# Altium project PCM.PrjPcb
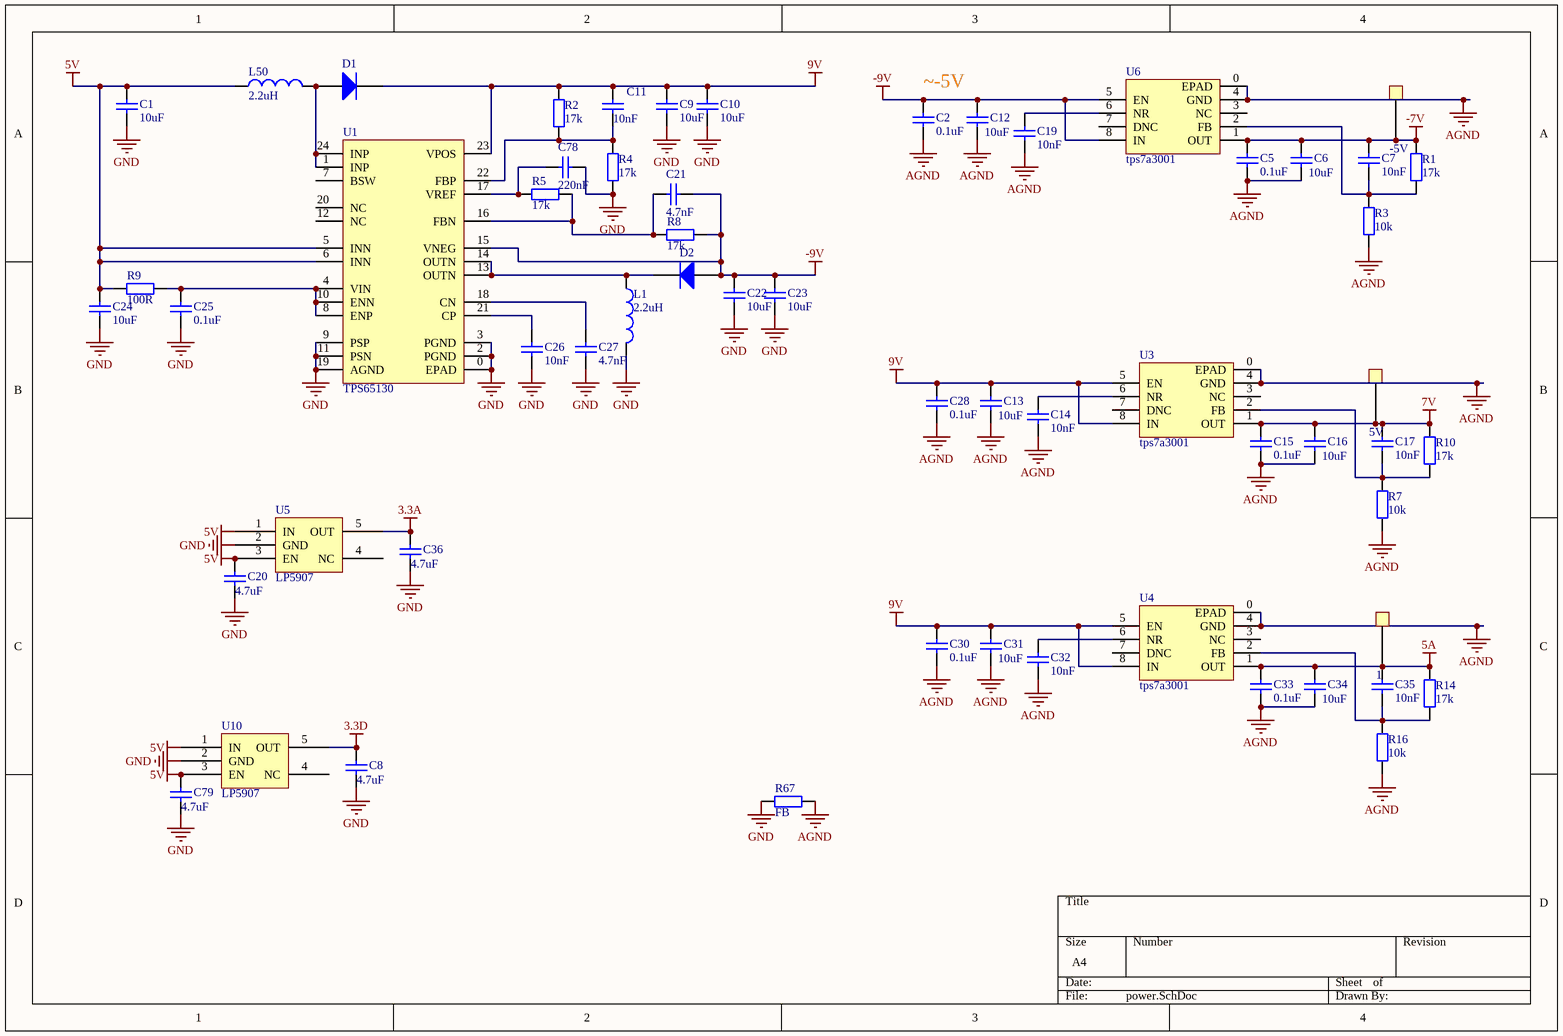
[diagram p0: power.SchDoc]
3 sheets, 169 parts. Net scope: flat (ports and power ports of the same name join across sheets).
Board file: PCM.PcbDoc
Sheets:
  power.SchDoc
  audio.SchDoc
  MCU.SchDoc

## Sheet power.SchDoc
size A4

### Parts
1  TestPad  [TestPad]  (value not drawn)
5V  TestPad  [TestPad]  (value not drawn)
-5V  TestPad  [TestPad]  (value not drawn)
C1  10uF  [0603L]
C2  0.1uF  [0603L]
C5  0.1uF  [0603L]
C6  10uF  [0805]
C7  10nF  [0402]
C8  4.7uF  [0603L]
C9  10uF  [0603L]
C10  10uF  [0603L]
C11  10nF  [0402]
C12  10uF  [0805]
C13  10uF  [0805]
C14  10nF  [0402]
C15  0.1uF  [0603L]
C16  10uF  [0805]
C17  10nF  [0402]
C19  10nF  [0402]
C20  4.7uF  [0603L]
C21  4.7nF  [0402]
C22  10uF  [0603L]
C23  10uF  [0603L]
C24  10uF  [0603L]
C25  0.1uF  [0402]
C26  10nF  [0402]
C27  4.7nF  [0402]
C28  0.1uF  [0603L]
C30  0.1uF  [0603L]
C31  10uF  [0805]
C32  10nF  [0402]
C33  0.1uF  [0603L]
C34  10uF  [0805]
C35  10nF  [0402]
C36  4.7uF  [0603L]
C78  220nF  [0402]
C79  4.7uF  [0603L]
D1  (no value)  [LC-SOD-323]
D2  (no value)  [LC-SOD-323]
L1  2.2uH  [L4015]
L50  2.2uH  [L4015]
R1  17k  [0402]
R2  17k  [0402]
R3  10k  [0402]
R4  17k  [0402]
R5  17k  [0402]
R7  10k  [0402]
R8  17k  [0402]
R9  100R  [0402]
R10  17k  [0402]
R14  17k  [0402]
R16  10k  [0402]
R67  FB  [0603L]
U1  TPS65130  [TPS65130]
U3  tps7a3001  [MSOP8/VSSOP8+PAD]
U4  tps7a3001  [MSOP8/VSSOP8+PAD]
U5  LP5907  [SOT23-5]
U6  tps7a3001  [MSOP8/VSSOP8+PAD]
U10  LP5907  [SOT23-5]

### Nets
3.3A: C36.2 U5.5(OUT)
3.3D: C8.2 U10.5(OUT)
5A: 1.1 C33.1 C34.2 C35.1 R14.2 U4.1(OUT)
5V: C1.1 C20.2 C24.1 C79.2 L50.1 R9.2 U1.5(INN) U1.6(INN) U5.1(IN) U5.3(EN) U10.1(IN) U10.3(EN)
7V: 5V.1 C15.1 C16.2 C17.1 R10.2 U3.1(OUT)
9V: C9.1 C10.1 C11.1 C13.2 C28.1 C30.1 C31.2 D1.2(K) R2.2 U1.23(VPOS) U3.5(EN) U3.8(IN) U4.5(EN) U4.8(IN)
-7V: -5V.1 C5.1 C6.2 C7.1 R1.2 U6.1(OUT)
-9V: C2.1 C12.2 C21.2 C22.1 C23.1 D2.1(A) R8.2 U1.15(VNEG) U6.5(EN) U6.8(IN)
AGND: C2.2 C5.2 C6.1 C12.1 C13.1 C14.2 C15.2 C16.1 C19.2 C28.2 C30.2 C31.1 C32.2 C33.2 C34.1 R3.1 R7.1 R16.1 R67.1 U3.0(EPAD) U3.4(GND) U4.0(EPAD) U4.4(GND) U6.0(EPAD) U6.4(GND)
GND: C1.2 C8.1 C9.2 C10.2 C20.1 C22.2 C23.2 C24.2 C25.2 C26.2 C27.2 C36.1 C78.2 C79.1 L1.2 R4.1 R67.2 U1.0(EPAD) U1.2(PGND) U1.3(PGND) U1.9(PSP) U1.11(PSN) U1.19(AGND) U5.2(GND) U10.2(GND)
NetC7_2: C7.2 R1.1 R3.2 U6.2(FB)
NetC11_2: C11.2 R2.1 R4.2 U1.22(FBP)
NetC14_1: C14.1 U3.6(NR)
NetC17_2: C17.2 R7.2 R10.1 U3.2(FB)
NetC19_1: C19.1 U6.6(NR)
NetC21_1: C21.1 R5.1 R8.1 U1.16(FBN)
NetC25_1: C25.1 R9.1 U1.4(VIN) U1.8(ENP) U1.10(ENN)
NetC26_1: C26.1 U1.21(CP)
NetC27_1: C27.1 U1.18(CN)
NetC32_1: C32.1 U4.6(NR)
NetC35_2: C35.2 R14.1 R16.2 U4.2(FB)
NetC78_1: C78.1 R5.2 U1.17(VREF)
NetD1_1: D1.1(A) L50.2 U1.1(INP) U1.24(INP)
NetD2_2: D2.2(K) L1.1 U1.13(OUTN) U1.14(OUTN)

Not connected (* = marked no-connect by the designer): U1 7(BSW) 12(NC) 20(NC); U3 3(NC) 7(DNC); U4 3(NC) 7(DNC); U5 4(NC); U6 3(NC) 7(DNC); U10 4(NC)

### Notes on the sheet
- ~-5V

### Library data of the parts
C1 C2 C5-C17 C19-C28 C30-C36 C78 C79 = Cap: Capacitor; Published: 8-Jun-2000; LatestRevisionDate: 17-Jul-2002; LatestRevisionNote: Re-released for DXP Platform.; PackageReference: RAD-0.3; Publisher: Altium Limited; PackageDescription: Radial Cap, Thru-Hole; 2 Leads; 0.3 in Pin Spacing
D1 D2 = Diode 1N4148: High Conductance Fast Diode; Published: 8-Jun-2000; LatestRevisionDate: 17-Jul-2002; LatestRevisionNote: Re-released for DXP Platform.; DatasheetVersion: 1997; PackageReference: DO-35; Publisher: Altium Limited; PackageDescription: Diode, Axial; Body 3.8 x 1.9 mm (LxDia. max), Lead Dia. 0.53 mm (max); Code_JEDEC: DO-204-AH; ComponentLink1Description: Manufacturer Link; ComponentLink1URL: http://www.fairchildsemi.com/; ComponentLink2Description: Datasheet; ComponentLink2URL: http://www.fairchildsemi.com/ds/1N%2F1N4148.pdf
L1 L50 = Inductor: Code_IEC: 1005; Published: 8-Jun-2000; LatestRevisionDate: 29-May-2009; LatestRevisionNote: IPC-7351 Footprint Added.; PackageReference: 0402-A; Publisher: Altium Limited; PackageDescription: Chip Inductor; Code_JEITA: 0402
R1-R5 R7-R10 R14 R16 R67 = Res2: Resistor; Published: 8-Jun-2000; LatestRevisionDate: 17-Jul-2002; LatestRevisionNote: Re-released for DXP Platform.; PackageReference: AXIAL-0.4; Publisher: Altium Limited; PackageDescription: Axial Device, Thru-Hole; 2 Leads; 0.4 in Pin Spacing

## Sheet audio.SchDoc
size A3
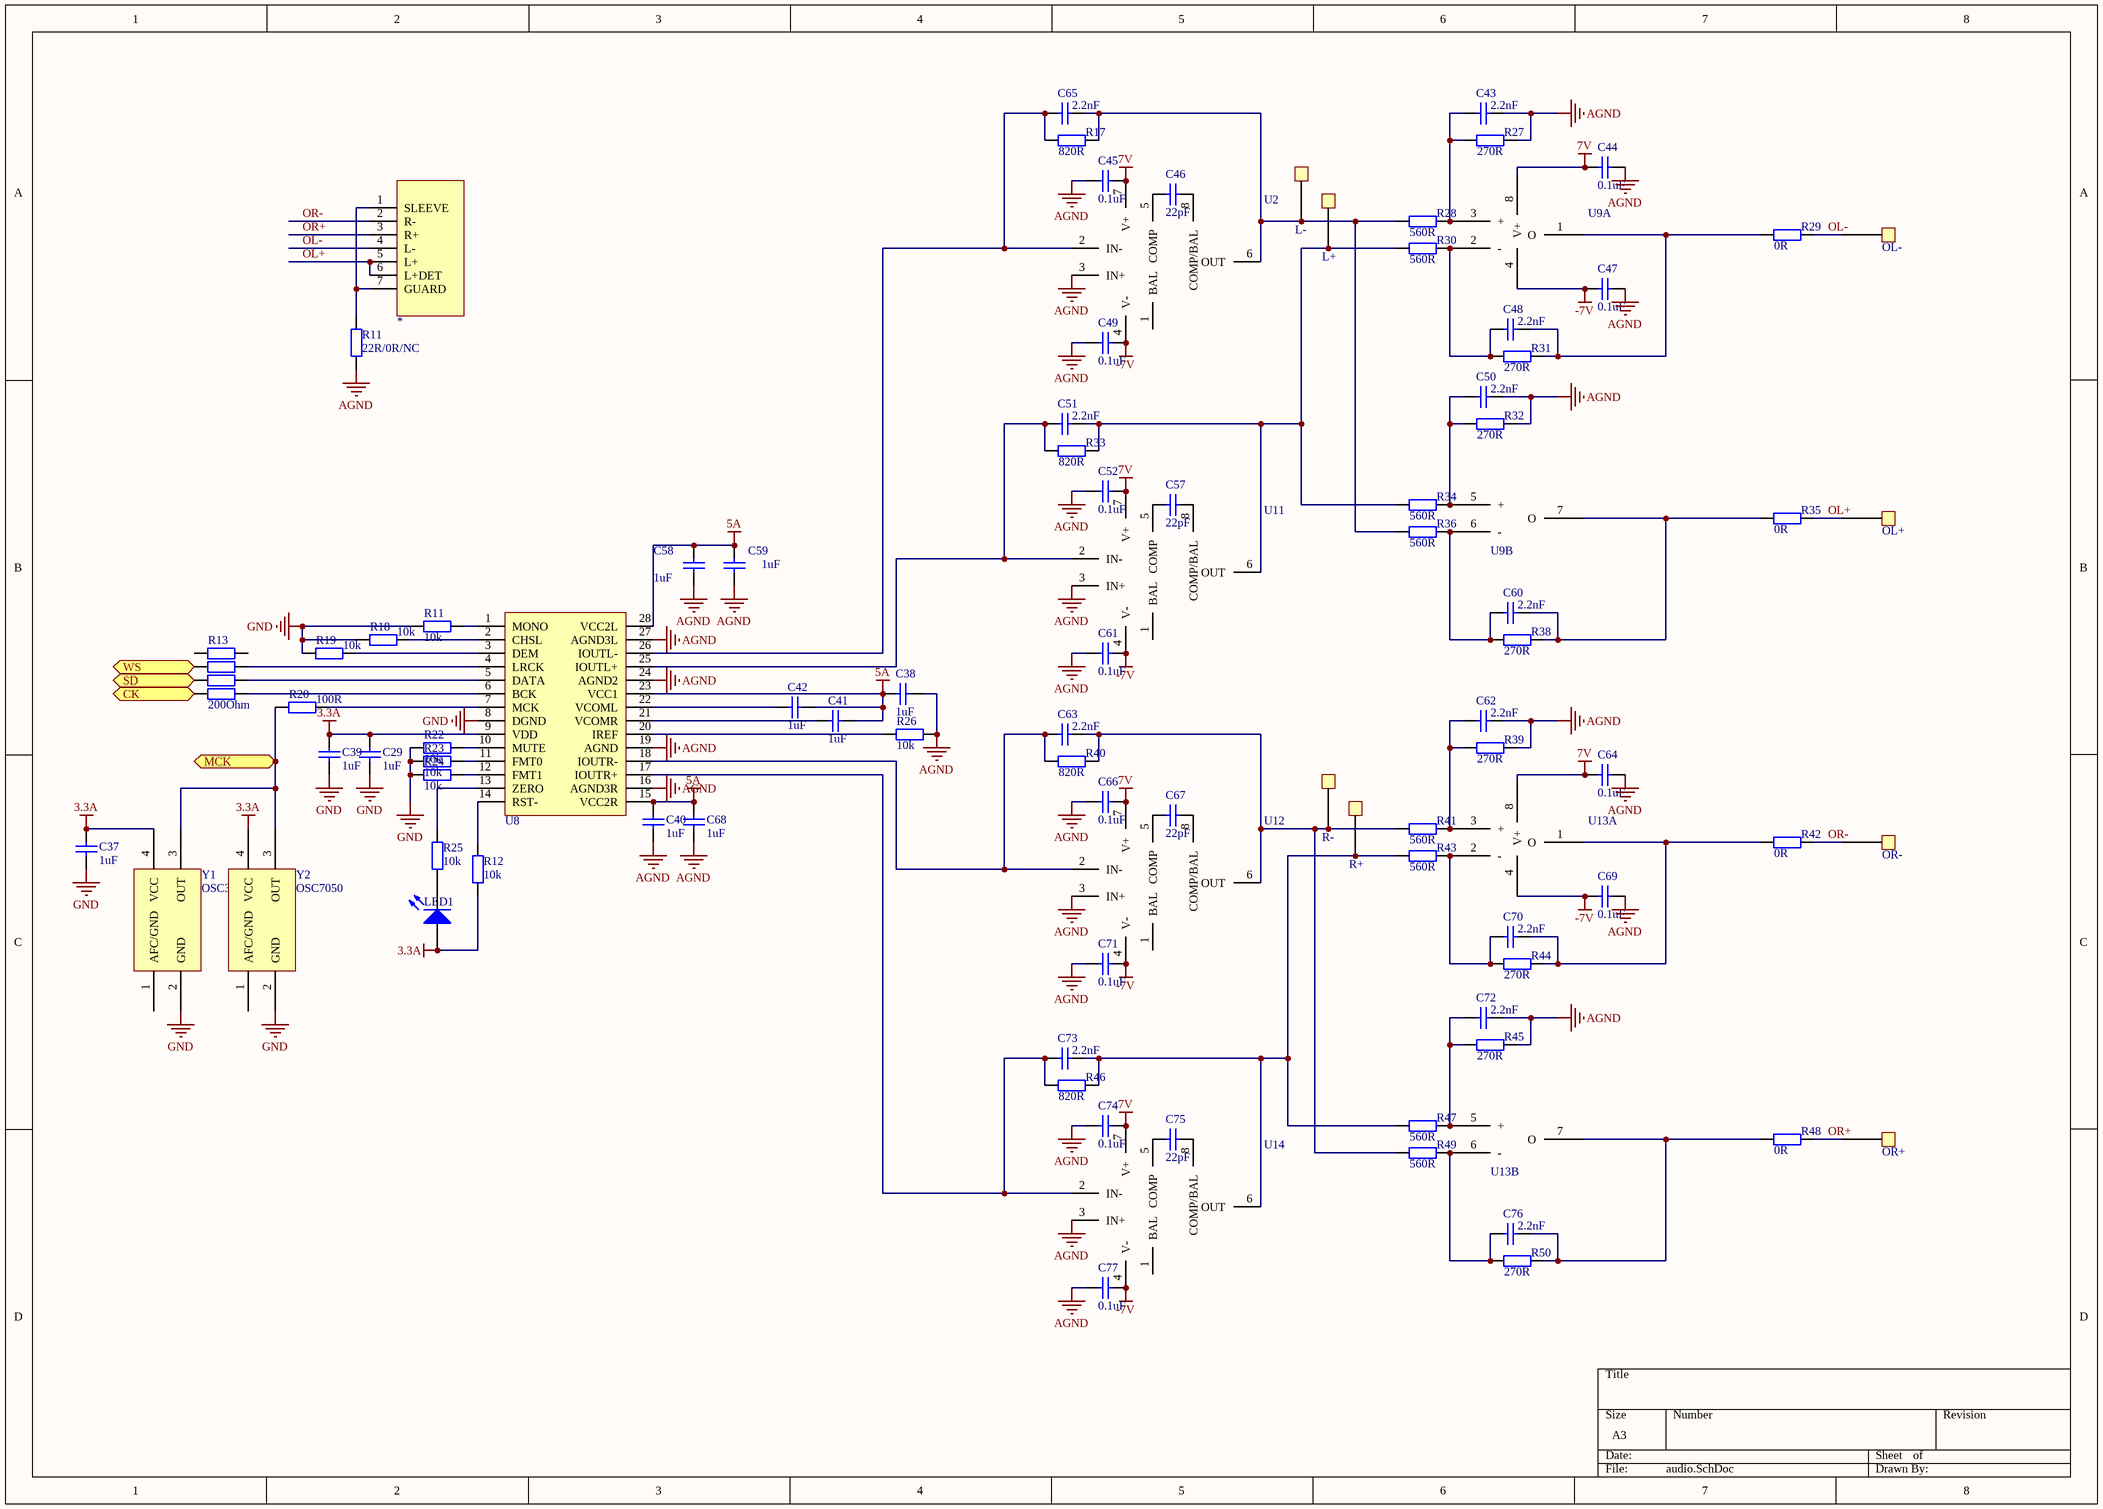
[diagram p1: audio.SchDoc]

### Parts
(Parts that share a designator on the sheet are numbered #1, #2 ... from top to bottom, then left to right.)
*  4.4BAL  [4.4BAL]  (value not drawn)
C29  1uF  [0402]
C37  1uF  [0402]
C38  1uF  [0603L]
C39  1uF  [0402]
C40  1uF  [0402]
C41  1uF  [1206]
C42  1uF  [1206]
C43  2.2nF  [0805]
C44  0.1uF  [0402]
C45  0.1uF  [0402]
C46  22pF  [0402]
C47  0.1uF  [0402]
C48  2.2nF  [0805]
C49  0.1uF  [0402]
C50  2.2nF  [0805]
C51  2.2nF  [0805]
C52  0.1uF  [0402]
C57  22pF  [0402]
C58  1uF  [0402]
C59  1uF  [0603L]
C60  2.2nF  [0805]
C61  0.1uF  [0402]
C62  2.2nF  [0805]
C63  2.2nF  [0805]
C64  0.1uF  [0402]
C65  2.2nF  [0805]
C66  0.1uF  [0402]
C67  22pF  [0402]
C68  1uF  [0603L]
C69  0.1uF  [0402]
C70  2.2nF  [0805]
C71  0.1uF  [0402]
C72  2.2nF  [0805]
C73  2.2nF  [0805]
C74  0.1uF  [0402]
C75  22pF  [0402]
C76  2.2nF  [0805]
C77  0.1uF  [0402]
L+  TestPad  [TestPad]  (value not drawn)
L-  TestPad  [TestPad]  (value not drawn)
LED1  LED0  [0603]  (value not drawn)
OL+  TestPad  [TestPad]  (value not drawn)
OL-  TestPad  [TestPad]  (value not drawn)
OR+  TestPad  [TestPad]  (value not drawn)
OR-  TestPad  [TestPad]  (value not drawn)
R11#1  22R/0R/NC  [0603L]
R11#2  10k  [0402]
R12  10k  [0402]
R13  value 200Ohm  [0402X4]  (hidden comment: Res*4)
R17  820R  [0402]
R18  10k  [0402]
R19  10k  [0402]
R20  100R  [0402]
R22  10k  [0402]
R23  10k  [0402]
R24  10k  [0402]
R25  10k  [0402]
R26  10k  [0603L]
R27  270R  [0402]
R28  560R  [0402]
R29  0R  [0603L]
R30  560R  [0402]
R31  270R  [0402]
R32  270R  [0402]
R33  820R  [0402]
R34  560R  [0402]
R35  0R  [0603L]
R36  560R  [0402]
R38  270R  [0402]
R39  270R  [0402]
R40  820R  [0402]
R41  560R  [0402]
R42  0R  [0603L]
R43  560R  [0402]
R44  270R  [0402]
R45  270R  [0402]
R46  820R  [0402]
R47  560R  [0402]
R48  0R  [0603L]
R49  560R  [0402]
R50  270R  [0402]
R+  TestPad  [TestPad]  (value not drawn)
R-  TestPad  [TestPad]  (value not drawn)
U2  NE5534  [SO8]  (value not drawn)
U8  PCM1794  [PCM1794]  (value not drawn)
U9  OP-2  [SO8]  (value not drawn)  (parts A,B of 2)
U11  NE5534  [SO8]  (value not drawn)
U12  NE5534  [SO8]  (value not drawn)
U13  OP-2  [SO8]  (value not drawn)  (parts A,B of 2)
U14  NE5534  [SO8]  (value not drawn)
Y1  OSC3225  [TXC_7Q]
Y2  OSC7050  [OSC7050]

### Ports
CK, MCK, SD, WS

### Nets
3.3A: C29.2 C37.2 C39.2 LED1.1(A) R12.1 U8.9(VDD) Y1.4(VCC) Y2.4(VCC)
5A: C38.1 C40.1 C41.2 C42.2 C58.1 C59.1 C68.1 U8.15(VCC2R) U8.23(VCC1) U8.28(VCC2L)
7V: C44.1 C45.2 C52.2 C64.1 C66.2 C74.2 U2.7(V+) U9.8(V+) U11.7(V+) U12.7(V+) U13.8(V+) U14.7(V+)
-7V: C47.1 C49.2 C61.2 C69.1 C71.2 C77.2 U2.4(V-) U9.4 U11.4(V-) U12.4(V-) U13.4 U14.4(V-)
AGND: C38.2 C40.2 C43.2 C44.2 C45.1 C47.2 C49.1 C50.2 C52.1 C58.2 C59.2 C61.1 C62.2 C64.2 C66.1 C68.2 C69.2 C71.1 C72.2 C74.1 C77.1 R11#1.2 R26.1 R27.1 R32.1 R39.1 R45.1 U2.3(IN+) U8.16(AGND3R) U8.19(AGND) U8.24(AGND2) U8.27(AGND3L) U11.3(IN+) U12.3(IN+) U14.3(IN+)
GND: C29.1 C37.1 C39.1 R11#2.2 R18.1 R19.1 R22.2 R23.2 R24.2 U8.8(DGND) Y1.2(GND) Y2.2(GND)
OL+: *.5(L+) *.6(L+DET) OL+.1 R35.1
OL-: *.4(L-) OL-.1 R29.1
OR+: *.3(R+) OR+.1 R48.1
OR-: *.2(R-) OR-.1 R42.1
PA15: R13.7 ; port WS
Net*_1: *.1(SLEEVE) *.7(GUARD) R11#1.1
NetC41_1: C41.1 U8.21(VCOMR)
NetC42_1: C42.1 U8.22(VCOML)
NetC43_1: C43.1 R27.2 R28.1 U9.3(+)
NetC46_1: C46.1 U2.5(COMP)
NetC46_2: C46.2 U2.8(COMP/BAL)
NetC48_1: C48.1 R30.1 R31.2 U9.2(-)
NetC48_2: C48.2 R29.2 R31.1 U9.1(O)
NetC50_1: C50.1 R32.2 R34.1 U9.5(+)
NetC51_1: C51.1 R33.2 U8.25(IOUTL+) U11.2(IN-)
NetC51_2: C51.2 L+.1 R30.2 R33.1 R34.2 U11.6(OUT)
NetC57_1: C57.1 U11.5(COMP)
NetC57_2: C57.2 U11.8(COMP/BAL)
NetC60_1: C60.1 R36.1 R38.2 U9.6(-)
NetC60_2: C60.2 R35.2 R38.1 U9.7(O)
NetC62_1: C62.1 R39.2 R41.1 U13.3(+)
NetC63_1: C63.1 R40.2 U8.18(IOUTR-) U12.2(IN-)
NetC63_2: C63.2 R40.1 R41.2 R49.2 R-.1 U12.6(OUT)
NetC65_1: C65.1 R17.2 U2.2(IN-) U8.26(IOUTL-)
NetC65_2: C65.2 L-.1 R17.1 R28.2 R36.2 U2.6(OUT)
NetC67_1: C67.1 U12.5(COMP)
NetC67_2: C67.2 U12.8(COMP/BAL)
NetC70_1: C70.1 R43.1 R44.2 U13.2(-)
NetC70_2: C70.2 R42.2 R44.1 U13.1(O)
NetC72_1: C72.1 R45.2 R47.1 U13.5(+)
NetC73_1: C73.1 R46.2 U8.17(IOUTR+) U14.2(IN-)
NetC73_2: C73.2 R43.2 R46.1 R47.2 R+.1 U14.6(OUT)
NetC75_1: C75.1 U14.5(COMP)
NetC75_2: C75.2 U14.8(COMP/BAL)
NetC76_1: C76.1 R49.1 R50.2 U13.6(-)
NetC76_2: C76.2 R48.2 R50.1 U13.7(O)
NetLED1_2: LED1.2(K) R25.1
NetR11#2_1: R11#2.1 U8.1(MONO)
NetR12_2: R12.2 U8.14(RST-)
NetR13_2: R13.2 U8.4(LRCK)
NetR13_3: R13.3 U8.5(DATA)
NetR13_4: R13.4 U8.6(BCK)
NetR13_5: R13.5 ; port CK
NetR13_6: R13.6 ; port SD
NetR18_2: R18.2 U8.2(CHSL)
NetR19_2: R19.2 U8.3(DEM)
NetR20_1: R20.1 Y1.3(OUT) Y2.3(OUT) ; port MCK
NetR20_2: R20.2 U8.7(MCK)
NetR22_1: R22.1 U8.10(MUTE)
NetR23_1: R23.1 U8.11(FMT0)
NetR24_1: R24.1 U8.12(FMT1)
NetR25_2: R25.2 U8.13(ZERO)
NetR26_2: R26.2 U8.20(IREF)

Not connected (* = marked no-connect by the designer): R13 1 8; U2 1(BAL); U11 1(BAL); U12 1(BAL); U14 1(BAL); Y1 1(AFC/GND); Y2 1(AFC/GND)

### Library data of the parts
C29 C37-C52 C57-C77 = Cap: Capacitor
LED1 = LED0: Typical INFRARED GaAs LED; Published: 8-Jun-2000; LatestRevisionDate: 08-Jul-2005; LatestRevisionNote: Mech Layer 1 removed.; PackageReference: LED-0; Publisher: Altium Limited; PackageDescription: LED; 2 Leads
R11#1 R11#2 R12 R17-R20 R22-R36 R38-R50 = Res2: Resistor; Value: 0Ohm; Published: 8-Jun-2000; LatestRevisionDate: 17-Jul-2002; LatestRevisionNote: Re-released for DXP Platform.; PackageReference: AXIAL-0.4; Publisher: Altium Limited; PackageDescription: Axial Device, Thru-Hole; 2 Leads; 0.4 in Pin Spacing
R13 = Res*4: Resistor; Published: 8-Jun-2000; LatestRevisionDate: 17-Jul-2002; LatestRevisionNote: Re-released for DXP Platform.; PackageReference: AXIAL-0.4; Publisher: Altium Limited; PackageDescription: Axial Device, Thru-Hole; 2 Leads; 0.4 in Pin Spacing
Y1 Y2 = OSC_40M

## Sheet MCU.SchDoc
size A4
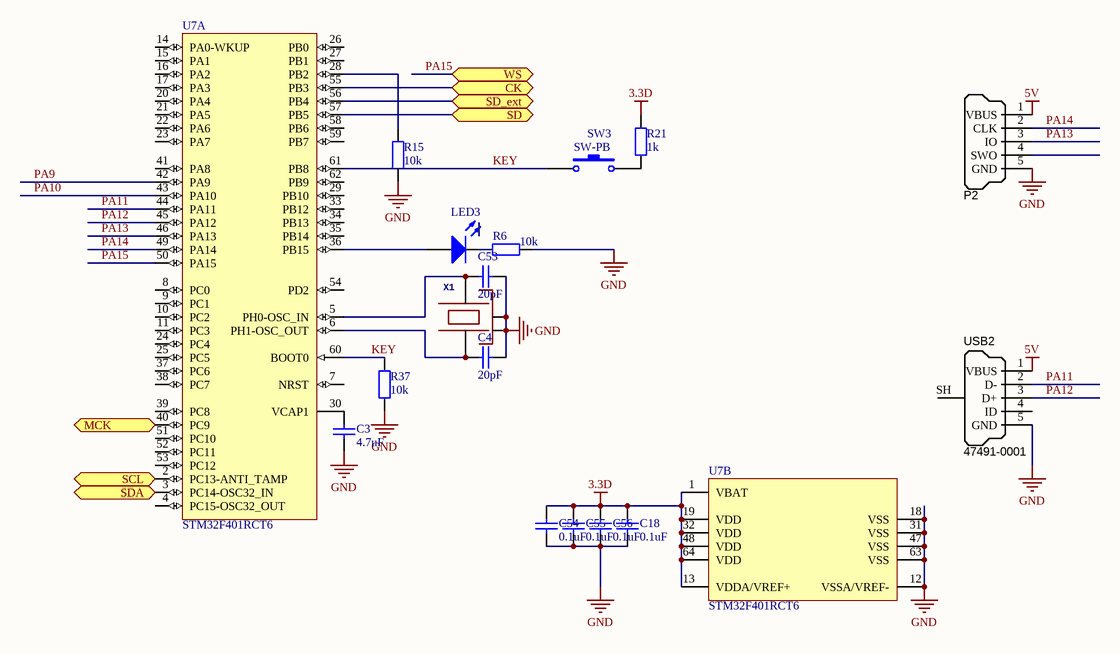
[diagram p2: MCU.SchDoc]

### Parts
C3  value 4.7uF  [0603L]  (hidden comment: Cap)
C4  value 20pF  [0402]  (hidden comment: Cap)
C18  value 0.1uF  [0402]  (hidden comment: Cap)
C53  value 20pF  [0402]  (hidden comment: Cap)
C54  value 0.1uF  [0402]  (hidden comment: Cap)
C55  value 0.1uF  [0402]  (hidden comment: Cap)
C56  value 0.1uF  [0402]  (hidden comment: Cap)
LED3  LED0  [0603]  (value not drawn)
P2  SWD_MicroUSB  [MICRO-YZX]  (value not drawn)
R6  10k  [0402]
R15  10k  [0402]
R21  1k  [0402]
R37  value 10k  [0402]  (hidden comment: Res2)
SW3  SW-PB  [SW3x4]
U7  STM32F401RCT6  [STM-LQFP64_N]  (parts A,B of 2)
USB2  Manufacturer Part Number 1: 47491-0001  [MICRO-YZX]  (hidden comment: USB Micro Type B)
X1  24.000 KHz 3.2x2.5mm 8-10pf  [OSCILLATOR-2.5x2.0]  (value not drawn)

### Ports
CK, MCK, SCL, SD, SD_ext, SDA, WS

### Nets
3.3D: C18.2 C54.2 C55.2 C56.2 R21.2 U7.1(VBAT) U7.13(VDDA/VREF+) U7.19(VDD) U7.32(VDD) U7.48(VDD) U7.64(VDD)
5V: P2.1(VBUS) USB2.1(VBUS)
GND: C3.1 C4.1 C18.1 C53.1 C54.1 C55.1 C56.1 P2.5(GND) R6.2 R15.2 R37.1 U7.12(VSSA/VREF-) U7.18(VSS) U7.31(VSS) U7.47(VSS) U7.63(VSS) USB2.5(GND) X1.2(NC_2) X1.4(NC_4)
KEY: R37.2 SW3.1 U7.60(BOOT0) U7.61(PB8)
PA9: U7.42(PA9)
PA10: U7.43(PA10)
PA11: U7.44(PA11) USB2.2(D-)
PA12: U7.45(PA12) USB2.3(D+)
PA13: P2.3(IO) U7.46(PA13)
PA14: P2.2(CLK) U7.49(PA14)
PA15: U7.50(PA15) ; port WS
NetC3_2: C3.2 U7.30(VCAP1)
NetC4_2: C4.2 U7.6(PH1-OSC_OUT) X1.1
NetC53_2: C53.2 U7.5(PH0-OSC_IN) X1.3
NetLED3_1: LED3.1(A) U7.36(PB15)
NetLED3_2: LED3.2(K) R6.1
NetR13_5: U7.55(PB3) ; port CK
NetR13_6: U7.57(PB5) ; port SD
NetR15_1: R15.1 U7.28(PB2)
NetR20_1: U7.40(PC9) ; port MCK
NetR21_1: R21.1 SW3.2
NetU7_2: U7.2(PC13-ANTI_TAMP) ; port SCL
NetU7_3: U7.3(PC14-OSC32_IN) ; port SDA
NetU7_56: U7.56(PB4) ; port SD_ext

Not connected (* = marked no-connect by the designer): P2 4(SWO); U7 4(PC15-OSC32_OUT) 7(NRST) 8(PC0) 9(PC1) 10(PC2) 11(PC3) 14(PA0-WKUP) 15(PA1) 16(PA2) 17(PA3) 20(PA4) 21(PA5) 22(PA6) 23(PA7) 24(PC4) 25(PC5) 26(PB0) 27(PB1) 29(PB10) 33(PB12) 34(PB13) 35(PB14) 37(PC6) 38(PC7) 39(PC8) 41(PA8) 51(PC10) 52(PC11) 53(PC12) 54(PD2) 58(PB6) 59(PB7) 62(PB9); USB2 4(ID) SH(Shell)

### Library data of the parts
C3 C4 C18 C53-C56 = Cap: Capacitor; Published: 8-Jun-2000; LatestRevisionDate: 17-Jul-2002; LatestRevisionNote: Re-released for DXP Platform.; PackageReference: RAD-0.3; Publisher: Altium Limited; PackageDescription: Radial Cap, Thru-Hole; 2 Leads; 0.3 in Pin Spacing
LED3 = LED0: Typical INFRARED GaAs LED; Published: 8-Jun-2000; LatestRevisionDate: 08-Jul-2005; LatestRevisionNote: Mech Layer 1 removed.; PackageReference: LED-0; Publisher: Altium Limited; PackageDescription: LED; 2 Leads
P2 = SWD_MicroUSB: Connector SMD USB Micro Type B middle mount; Manufacturer 1: Molex Inc; SCDType: undef; Package / Case: SMD; Supplier 1: Digi-Key; Supplier Part Number 1: WM17142CT-ND
R6 R15 R21 = Res2: Resistor; Value: 0Ohm; Published: 8-Jun-2000; LatestRevisionDate: 17-Jul-2002; LatestRevisionNote: Re-released for DXP Platform.; PackageReference: AXIAL-0.4; Publisher: Altium Limited; PackageDescription: Axial Device, Thru-Hole; 2 Leads; 0.4 in Pin Spacing
R37 = Res2: Resistor; Published: 8-Jun-2000; LatestRevisionDate: 17-Jul-2002; LatestRevisionNote: Re-released for DXP Platform.; PackageReference: AXIAL-0.4; Publisher: Altium Limited; PackageDescription: Axial Device, Thru-Hole; 2 Leads; 0.4 in Pin Spacing
SW3 = SW-PB: Switch; Published: 24-Mar-1999; LatestRevisionDate: 17-Jul-2002; LatestRevisionNote: Re-released for DXP Platform.; PackageReference: SPST-2; Publisher: Altium Limited; PackageDescription: Switch; 2 Leads
U7 = STM32F401RCT6: ARM Cortex-M4 32-bit MCU+FPU, 105 DMIPS, 256 kB Flash, 64 kB Internal RAM, 48 I/Os, 64-pin LQFP, -40 to 85 degC, Tray; Manufacturer: STMicroelectronics; FLASH Size (Prog) (kB): 256; I/Os (High Current): 48; Internal RAM Size (kB): 64; Operating Frequency(F) (Processor speed) (MHz): 84; Supply Voltage(Vcc) max (V): 3.6; Supply Voltage(Vcc) min (V): 1.8; DatasheetVersion: Rev. 1; PackageVersion: Rev. 4, 06/2013; PackageReference: LQFP64; PackageDescription: 64-Pin Low Profile Quad Flat Package, 10 x 10 mm Body, 0.5 mm Pitch; Supplier 1: Digi-Key; Supplier Part Number 1: 497-14047-ND; Supplier 2: Newark; Supplier Part Number 2: 19X6221; Supplier 3: Mouser; Supplier Part Number 3: 511-STM32F401RCT6; Core: ARM Cortex-M4; Packing: Tray; Mounting Technology: Surface Mount; PartNumber: STM32F401RCT6; ComponentLink1Description: Manufacturer URL; ComponentLink1URL: http://www.st.com/web/en/home.html; ComponentLink2Description: Datasheet; ComponentLink2URL: http://www.st.com/st-web-ui/static/active/en/resource/technical/document/data_brief/DM00071938.pdf; ComponentLink3Description: Package Specification; ComponentLink3URL: http://www.st.com/st-web-ui/static/active/en/resource/technical/document/datasheet/DM00037051.pdf
USB2 = USB_Micro_TypeB: Connector SMD USB Micro Type B middle mount; Manufacturer 1: Molex Inc; SCDType: undef; Package / Case: SMD; Supplier 1: Digi-Key; Supplier Part Number 1: WM17142CT-ND
X1 = OSCILLATOR-3.2X2.5: Crystal Oscillator in 3.2x2.5 SMD

## Nets that join several sheets
3.3A: power (C36.2 U5.5), audio (8 pins)
3.3D: power (C8.2 U10.5), MCU (11 pins)
5A: power (6 pins), audio (10 pins)
5V: power (12 pins), MCU (P2.1 USB2.1)
7V: power (6 pins), audio (12 pins)
-7V: power (6 pins), audio (12 pins)
AGND: power (25 pins), audio (35 pins)
GND: power (25 pins), audio (12 pins), MCU (19 pins)
NetR13_5: audio (R13.5), MCU (U7.55)
NetR13_6: audio (R13.6), MCU (U7.57)
NetR20_1: audio (R20.1 Y1.3 Y2.3), MCU (U7.40)
PA15: audio (R13.7), MCU (U7.50)